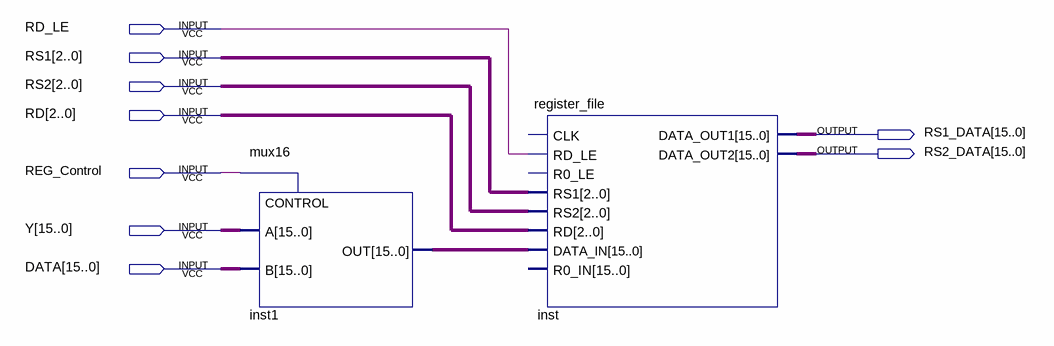
[diagram p0: schematic sheet]
// Quartus schematic Registers.bdf as structural Verilog: 2 symbols, 9 pins
module Registers (
  input  RD_LE,
  input  [2:0] RS1,
  input  [2:0] RS2,
  input  [2:0] RD,
  input  REG_Control,
  input  [15:0] Y,
  input  [15:0] DATA,
  output [15:0] RS1_DATA,
  output [15:0] RS2_DATA
);

  wire [15:0] inst1_out;

  mux16 inst1 (.A(Y), .B(DATA), .CONTROL(REG_Control), .OUT(inst1_out));
  register_file inst (
    .RD_LE(RD_LE), .RS1(RS1), .RS2(RS2), .RD(RD), .DATA_IN(inst1_out), .DATA_OUT1(RS1_DATA),
    .DATA_OUT2(RS2_DATA));  // open: CLK, R0_LE, R0_IN
endmodule
